# EasyEDA Pro project ProProject_keyboard_Tassel43_2024-03-30.epro, board Tassel43_Without_RGB_Mid
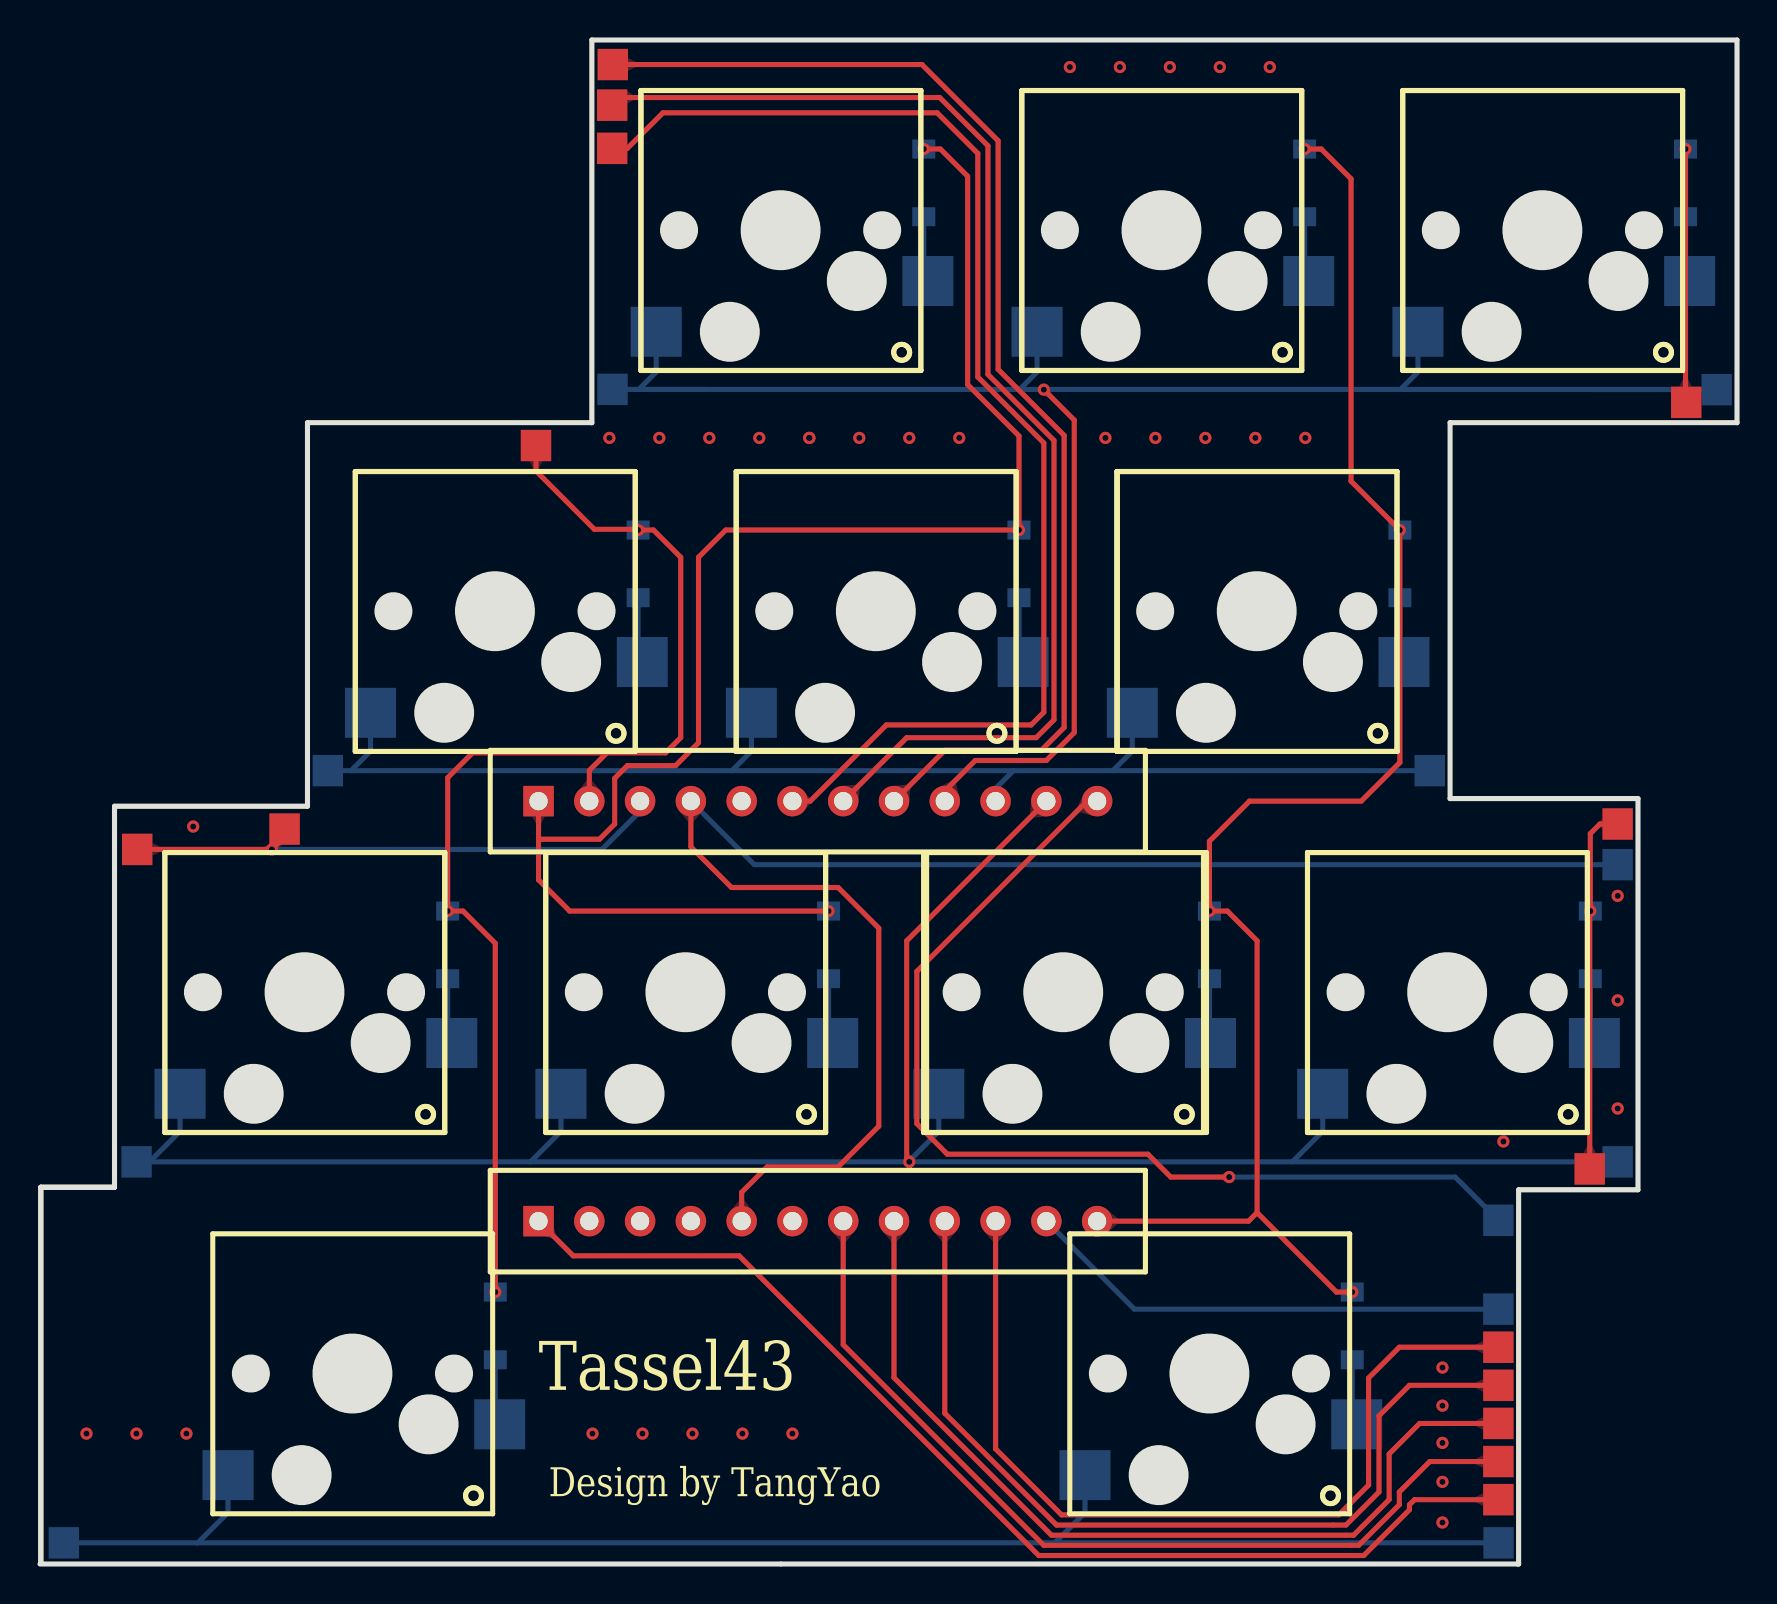
[diagram p5: board, top side]
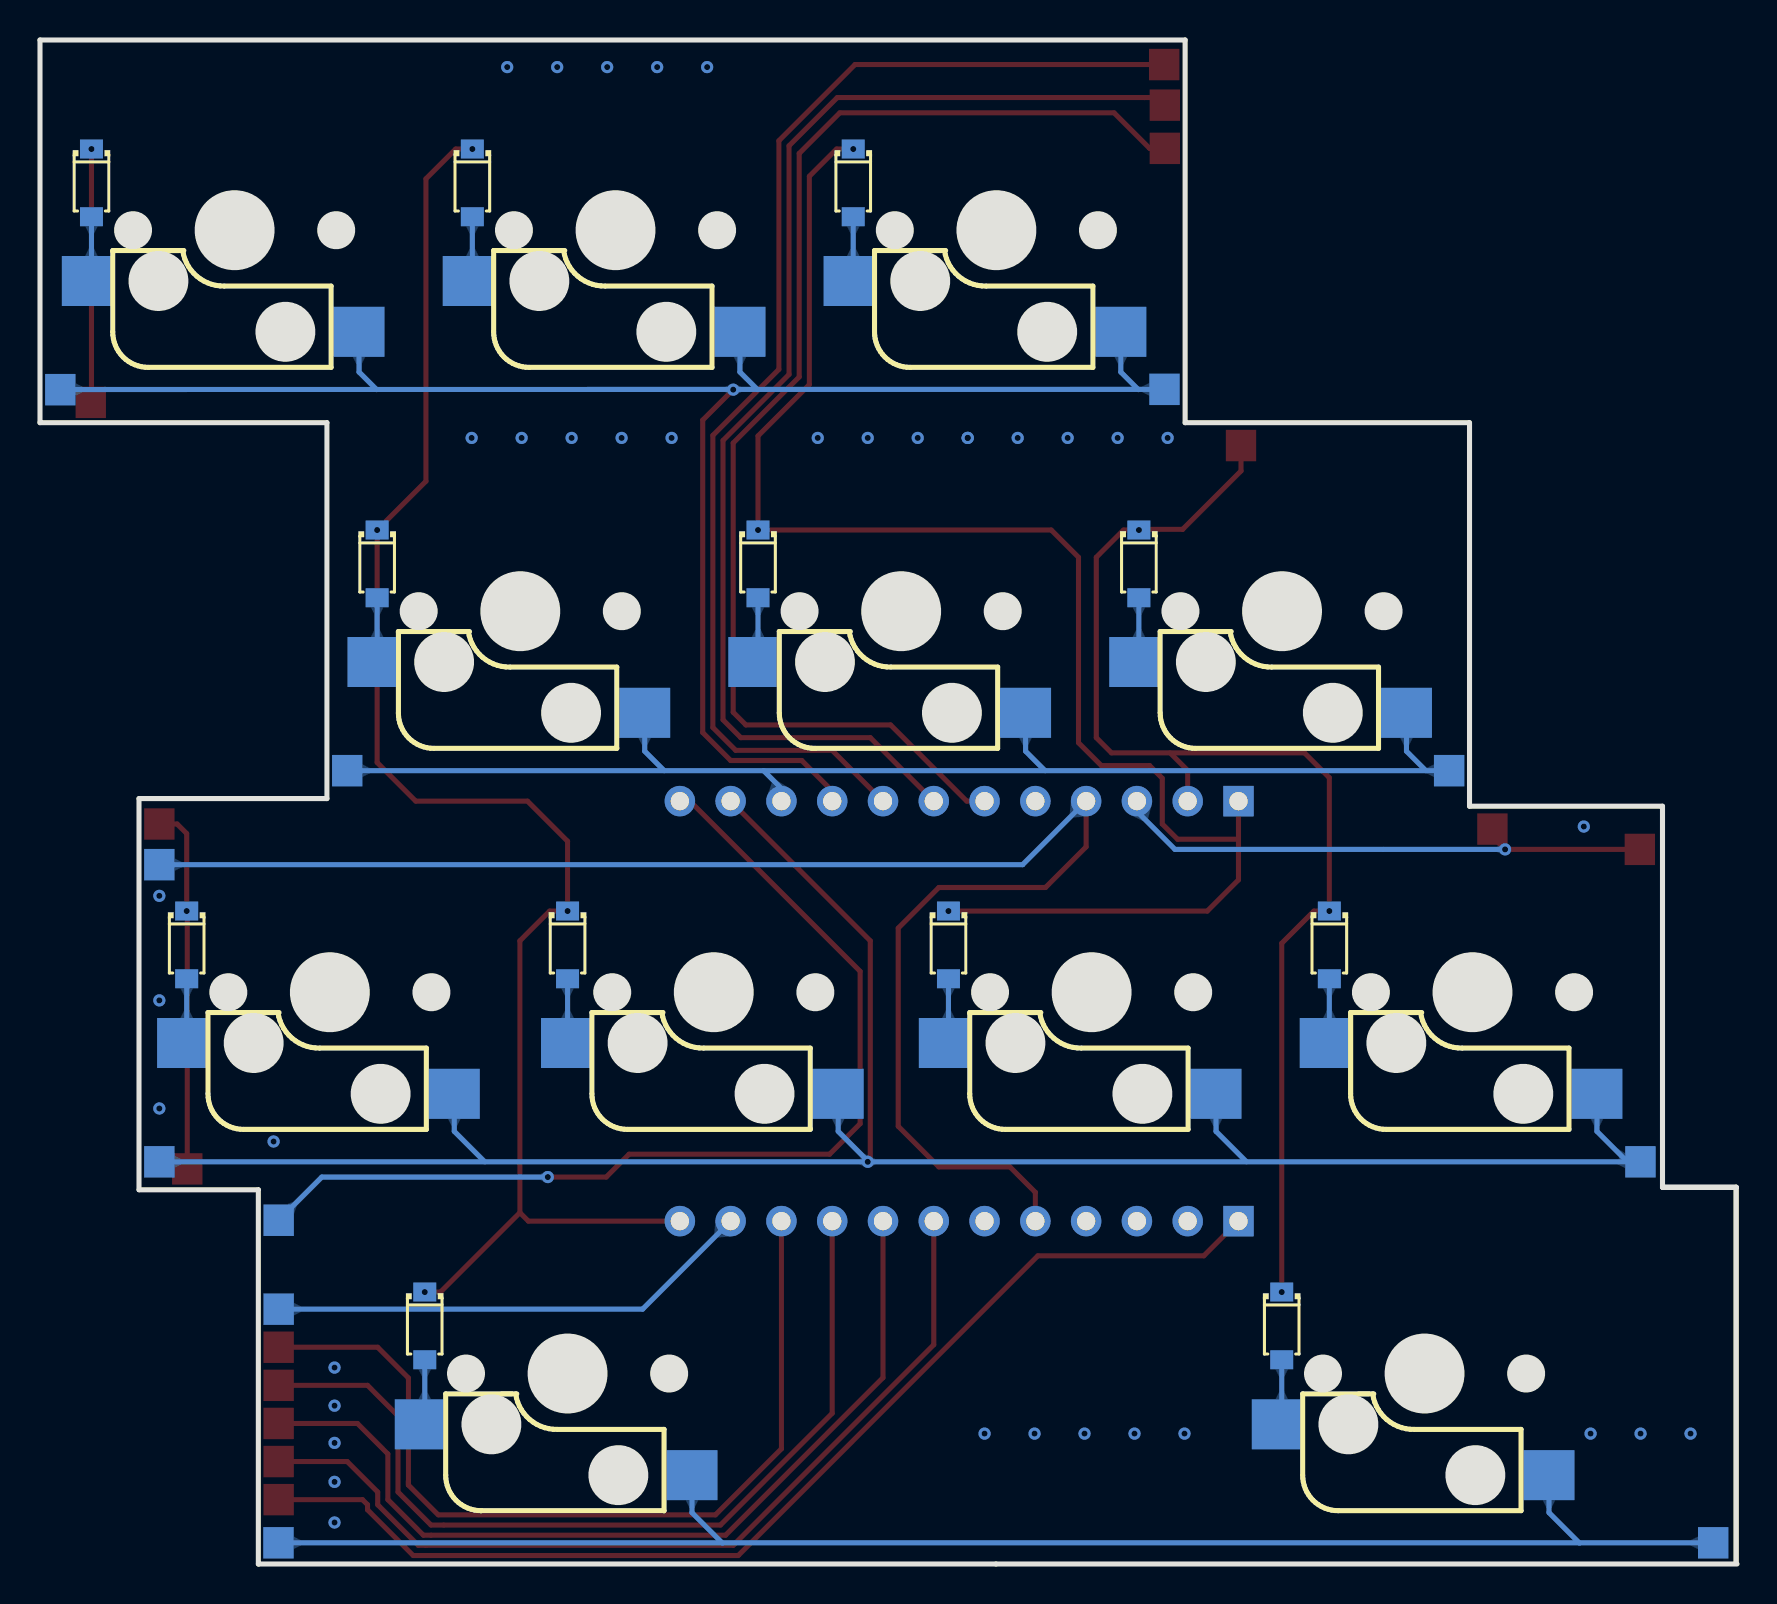
[diagram p6: board, bottom side, seen from below]

Outline 84.88 x 76.2 mm; copper layers: Top Layer, Bottom Layer. Coordinates in mm from the lower left corner of the outline.
Outline path: 0.04,18.84 0.04,0.04 0.04,18.84 ; 0.04,18.84 3.73,18.84 ; 0.04,18.84 3.73,18.84 ; 3.73,18.84 3.73,37.89 13.38,37.89 13.38,57.07 27.6,57.07 27.6,76.2 84.88,76.2 84.88,57.07 70.53,57.07 70.53,38.27 79.93,38.27 79.93,18.71 73.96,18.71 73.96,0 0,0
Stack: Top Layer 0.035mm / Dielectric1 1.51mm FR4 er 4.5 / Bottom Layer 0.035mm

## Design rules (mm)
spacing Default (default): track to track 0.152, other pairs 0 to 0.152
track width Default (default): min 0.254, default 0.254, max 25.4
differential pair differentialPair (default): width min 0.127, default 0.254, max 2.54; gap min 0.152, default 0.152
via Default (default): diameter min 0.61, default 0.61, max 100.025; hole min 0.305, default 0.305, max 59.995
net GND uses gge64594(1)
pour e267 uses gge64594
pour e689 uses gge64594(1)

## Placement (name value [footprint] x y rotation side)
B  -  [凯华热插拨]  51.18 28.59 0 top
C  -  [凯华热插拨]  13.23 28.59 0 top
D43  1N4148W  [SOD-123_L2.8-W1.8-LS3.7-RD]  22.77 11.9 270 bottom
D45  1N4148W  [SOD-123_L2.8-W1.8-LS3.7-RD]  65.63 11.9 270 bottom
D56  1N4148W  [SOD-123_L2.8-W1.8-LS3.7-RD]  20.39 30.96 270 bottom
D57  1N4148W  [SOD-123_L2.8-W1.8-LS3.7-RD]  39.44 30.96 270 bottom
D58  1N4148W  [SOD-123_L2.8-W1.8-LS3.7-RD]  58.49 30.96 270 bottom
D59  1N4148W  [SOD-123_L2.8-W1.8-LS3.7-RD]  77.54 30.96 270 bottom
D69  1N4148W  [SOD-123_L2.8-W1.8-LS3.7-RD]  29.92 50.01 270 bottom
D70  1N4148W  [SOD-123_L2.8-W1.8-LS3.7-RD]  48.97 50.01 270 bottom
D71  1N4148W  [SOD-123_L2.8-W1.8-LS3.7-RD]  68.02 50.01 270 bottom
D80  1N4148W  [SOD-123_L2.8-W1.8-LS3.7-RD]  82.3 69.06 270 bottom
D81  1N4148W  [SOD-123_L2.8-W1.8-LS3.7-RD]  63.25 69.06 270 bottom
D82  1N4148W  [SOD-123_L2.8-W1.8-LS3.7-RD]  44.2 69.06 270 bottom
F  -  [凯华热插拨]  22.76 47.64 0 top
G  -  [凯华热插拨]  41.81 47.64 0 top
H  -  [凯华热插拨]  60.86 47.64 0 top
LGUI6  -  [凯华热插拨]  15.63 9.52 0 top
LGUI7  -  [凯华热插拨]  58.49 9.52 0 top
N  -  [凯华热插拨]  70.38 28.59 0 top
NOREF  -  [Pad_e539]  4.86 35.73 0 top
NOREF#2  -  [Pad_e538]  28.62 72.94 0 top
NOREF#3  -  [Pad_e127]  4.83 20.11 0 top
NOREF#4  -  [Pad_e263]  78.91 20.11 0 top
NOREF#5  -  [Pad_e684]  72.94 5.12 0 top
NOREF#6  -  [Pad_e537]  28.65 74.97 0 top
NOREF#7  -  [Pad_e264]  78.91 34.97 0 top
NOREF#8  -  [Pad_e265]  69.51 39.67 0 top
NOREF#9  -  [Pad_e688]  82.34 58.08 0 top
NOREF#10  -  [Pad_e683]  72.94 7.03 0 top
NOREF#11  -  [Pad_e262]  72.94 17.19 0 top
NOREF#12  -  [Pad_e685]  72.94 3.22 0 top
NOREF#13  -  [Pad_e682]  72.94 8.93 0 top
NOREF#14  -  [Pad_e540]  24.81 55.92 0 top
NOREF#15  -  [Pad_e535]  12.23 36.75 0 top
NOREF#16  -  [Pad_e125]  14.4 39.67 0 top
NOREF#17  -  [Pad_e261]  72.95 1.06 0 top
NOREF#18  -  [Pad_e686]  77.51 19.76 0 top
NOREF#19  -  [Pad_e687]  78.91 37 0 top
NOREF#20  -  [Pad_e266]  83.86 58.72 0 top
NOREF#21  -  [Pad_e124]  1.19 1.06 0 top
NOREF#22  -  [Pad_e536]  28.62 70.78 0 top
NOREF#23  -  [Pad_e126]  28.63 58.73 0 top
NOREF#24  -  [Pad_e541]  72.94 10.84 0 top
NOREF#25  -  [Pad_e260]  72.94 12.74 0 top
T  -  [凯华热插拨]  37.04 66.69 0 top
U  -  [凯华热插拨]  75.14 66.69 0 top
U5  -  [1X12排针]  27.47 14.6 90 top
U6  -  [1X12排针]  27.47 35.6 90 top
V  -  [凯华热插拨]  32.28 28.59 0 top
Y  -  [凯华热插拨]  56.09 66.69 0 top

## Footprints (pads in the part's own frame, mm; a bottom-side part is the same pattern mirrored in y, then rotated)
1X12排针
  rect 1.524x1.524 hole 0.914: 1(2.54,2.54)
  round 1.524 hole 0.914: 2(2.541,0) 3(2.541,-2.54) 4(2.541,-5.08) 5(2.541,-7.62) 6(2.541,-10.16) 7(2.541,-12.7) 8(2.541,-15.24) 9(2.541,-17.78) 10(2.541,-20.32) 11(2.541,-22.86) 12(2.541,-25.4)
Pad_e124
  rect 1.52x1.57 smd far side: 34(0,0)
Pad_e125
  rect 1.52x1.57 smd far side: 35(0,0)
Pad_e126
  rect 1.52x1.57 smd far side: 30(0,0)
Pad_e127
  rect 1.52x1.57 smd far side: 33(0,0)
Pad_e260
  rect 1.52x1.57 smd far side: 38(0,0)
Pad_e261
  rect 1.52x1.57 smd far side: 50(0,0)
Pad_e262
  rect 1.52x1.57 smd far side: 52(0,0)
Pad_e263
  rect 1.52x1.57 smd far side: 56(0,0)
Pad_e264
  rect 1.52x1.57 smd far side: 58(0,0)
Pad_e265
  rect 1.52x1.57 smd far side: 62(0,0)
Pad_e266
  rect 1.52x1.57 smd far side: 66(0,0)
Pad_e535
  rect 1.52x1.57 smd: 31(0,0)
Pad_e536
  rect 1.52x1.57 smd: 9(0,0)
Pad_e537
  rect 1.52x1.57 smd: 28(0,0)
Pad_e538
  rect 1.52x1.57 smd: 29(0,0)
Pad_e539
  rect 1.52x1.57 smd: 32(0,0)
Pad_e540
  rect 1.52x1.57 smd: 36(0,0)
Pad_e541
  rect 1.52x1.57 smd: 33(0,0)
Pad_e682
  rect 1.52x1.57 smd: 42(0,0)
Pad_e683
  rect 1.52x1.57 smd: 44(0,0)
Pad_e684
  rect 1.52x1.57 smd: 46(0,0)
Pad_e685
  rect 1.52x1.57 smd: 48(0,0)
Pad_e686
  rect 1.52x1.57 smd: 55(0,0)
Pad_e687
  rect 1.52x1.57 smd: 60(0,0)
Pad_e688
  rect 1.52x1.57 smd: 64(0,0)
SOD-123_L2.8-W1.8-LS3.7-RD
  rect 0.95x1.15 smd: 1(-1.692,0) 2(1.692,0)
凯华热插拨
  rect 2.55x2.5 smd far side: K1(-6.223,-5.08) K2(7.366,-2.54)

## Nets
GND: U5.6 U6.5
V1_4: D57.2 V.K2
VCC: NOREF#7.58 U5.5 U6.4
B1_4: B.K2 D58.2
C9_4: C.K2 D56.2
CAPLED: NOREF#12.48 U5.1
COL0: NOREF#6.28 U6.8
COL1: NOREF#2.29 U6.7
COL2: NOREF#22.9 U6.6
COL3: NOREF.32 NOREF#15.31 U6.3
COL4: D43.1 D56.1 D69.1 NOREF#14.36 U6.2
COL5: D57.1 D70.1 D82.1 U6.1
COL6: D45.1 D58.1 D71.1 D81.1 U5.12
COL7: D59.1 D80.1 NOREF#9.64 NOREF#18.55 NOREF#19.60 NOREF#25.38 U5.11
COL8: NOREF#24.33 U5.10
COL9: NOREF#13.42 U5.9
COL10: NOREF#10.44 U5.8
COL11: NOREF#5.46 U5.7
D80_2: D80.2 U.K2
D81_2: D81.2 Y.K2
D82_2: D82.2 T.K2
D+: U5.3
D-: U5.2
F1_4: D69.2 F.K2
G1_4: D70.2 G.K2
H1_4: D71.2 H.K2
N1_4: D59.2 N.K2
RGB: U5.4
ROW0: NOREF#20.66 NOREF#23.30 T.K1 U.K1 U6.9 Y.K1
ROW1: F.K1 G.K1 H.K1 NOREF#8.62 NOREF#16.35 U6.10
ROW2: B.K1 C.K1 N.K1 NOREF#3.33 NOREF#4.56 U6.11 V.K1
ROW3: LGUI6.K1 LGUI7.K1 NOREF#11.52 NOREF#17.50 NOREF#21.34 U6.12
RSHIFT1_4: D45.2 LGUI7.K2
SPACE1_4: D43.2 LGUI6.K2

## Via types
v1: diameter 0.61, hole 0.305, Top Layer to Bottom Layer, 53 vias

## Routing (per net, layer and track width the routed paths; a pad name or vN(x,y) marks a point on that pad's centre or on a via; arc(x,y) is an arc through that point)
GND:
  vias: v1(2.33,6.52) v1(4.83,6.52) v1(7.33,6.52) v1(7.66,36.87) v1(27.63,6.52) v1(28.48,56.3) v1(30.13,6.52) v1(30.98,56.3) v1(32.63,6.52) v1(33.48,56.3) v1(35.13,6.52) v1(35.98,56.3) v1(37.63,6.52) v1(38.48,56.3) v1(38.48,56.3) v1(40.98,56.3) v1(43.48,56.3) v1(45.98,56.3) v1(51.51,74.85) v1(53.29,56.3) v1(54.01,74.85) v1(55.79,56.3) v1(56.51,74.85) v1(58.29,56.3) v1(59.01,74.85) v1(60.79,56.3) v1(61.51,74.85) v1(63.29,56.3) v1(70.15,9.82) v1(70.15,7.92) v1(70.15,6.06) v1(70.15,4.11) v1(70.15,2.08) v1(73.19,21.12) v1(78.91,33.41) v1(78.91,28.18) v1(78.91,22.78)
V1_4: length 3.3
  Bottom Layer w0.254: V.K2 39.44,26.26 D57.2
VCC: length 80.6
  Top Layer w0.254: 32.56,38.14 32.56,35.86 34.59,33.83 39.92,33.83 41.95,31.79 41.95,21.89 39.92,19.86 36.37,19.86 35.09,18.59 35.09,17.14
  Bottom Layer w0.254: 78.93,34.97 35.73,34.97 32.56,38.14
B1_4: length 3.2
  Bottom Layer w0.254: B.K2 58.49,26.1 D58.2
C9_4: length 3.3
  Bottom Layer w0.254: 20.6,26.05 20.39,26.26 D56.2
CAPLED: length 56.2
  Top Layer w0.254: 24.94,17.14 26.67,15.41 34.97,15.41 49.95,0.42 66.21,0.42 68.5,2.71 68.5,2.96 68.75,3.22 NOREF#12.48
COL0: length 61.6
  Top Layer w0.254: 42.72,38.14 45.25,40.68 50.08,40.68 51.22,41.83 51.22,56.43 47.92,59.73 47.92,71.16 44.11,74.97 NOREF#6.28
COL1: length 62.3
  Top Layer w0.254: 29.66,73.32 29,73.32 NOREF#2.29 ; 40.18,38.14 43.35,41.32 49.83,41.32 50.72,42.21 50.72,56.18 47.41,59.48 47.41,70.91 45,73.32 29.63,73.32
COL2: length 63.6
  Top Layer w0.254: NOREF#22.9 29.38,70.78 31.16,72.56 44.87,72.56 46.91,70.53 46.91,59.35 50.21,56.05 50.21,42.59 49.57,41.95 42.33,41.95 38.52,38.14 37.63,38.14
COL3: length 27.7
  Top Layer w0.254: NOREF#15.31 12.23,36.37 v1(11.6,35.73) NOREF.32
  Bottom Layer w0.254: v1(11.6,35.73) 28.11,35.73 30.02,37.64 30.02,38.14
COL4: length 61.7
  Top Layer w0.254: 28.35,40.56 27.48,39.68 U6.2 ; NOREF#14.36 24.81,54.65 27.73,51.73 29.92,51.73 ; 22.77,13.6 22.77,31.04 21.16,32.65 20.39,32.65 20.39,39.31 21.63,40.56 31.28,40.56 32.05,41.32 32.05,50.34 30.68,51.7 v1(29.92,51.7)
  vias: v1(20.39,32.65) v1(22.77,13.6)
COL5: length 77.8
  Top Layer w0.254: 44.2,70.75 45.03,70.75 46.4,69.39 46.4,58.97 48.97,56.4 48.97,51.7 34.3,51.7 32.94,50.34 32.94,41.06 31.79,39.92 29.38,39.92 28.75,39.29 28.75,37 27.98,36.24 24.94,36.24 ; 24.94,38.14 24.94,34.21 26.49,32.65 39.44,32.65
  vias: v1(39.44,32.65) v1(44.2,70.75) v1(48.97,51.7)
COL6: length 79
  Top Layer w0.254: 60.88,17.57 64.85,13.6 65.63,13.6 ; 60.88,17.57 60.88,31.16 59.39,32.65 58.49,32.65 58.49,36.14 60.5,38.14 66.08,38.14 68.02,40.08 v1(68.02,51.7) 65.58,54.14 65.58,69.26 64.08,70.75 v1(63.25,70.75) ; 60.88,17.57 60.45,17.14 U5.12
  vias: v1(58.49,32.65) v1(65.63,13.6)
COL7: length 55.4
  Top Layer w0.254: 82.3,70.75 82.3,58.17 ; 78.93,37 78.02,37 77.54,36.52 77.54,32.65 ; NOREF#18.55 77.51,32.68
  Bottom Layer w0.254: NOREF#25.38 54.74,12.74 50.34,17.14
  vias: v1(77.54,32.65) v1(82.3,70.75)
COL8: length 44.7
  Top Layer w0.254: 66.45,3.95 66.45,9.3 67.99,10.84 NOREF#24.33 ; 66.45,4.17 66.45,3.95 64.96,2.46 ; 47.8,17.14 47.8,5.76 51.1,2.46 64.94,2.46
COL9: length 44.7
  Top Layer w0.254: NOREF#13.42 68.5,8.93 66.97,7.41 66.97,3.6 65.32,1.95 50.84,1.95 45.25,7.54 45.25,17.14
COL10: length 45
  Top Layer w0.254: NOREF#10.44 69,7.03 67.48,5.5 67.48,3.22 65.7,1.44 50.59,1.44 42.72,9.31 42.72,17.14
COL11: length 45.2
  Top Layer w0.254: NOREF#5.46 69.51,5.12 67.99,3.6 67.99,2.96 65.96,0.93 50.21,0.93 40.18,10.97 40.18,17.14
D80_2: length 3.3
  Bottom Layer w0.254: 82.3,67.36 82.3,64.36 82.51,64.15
D81_2: length 3.3
  Bottom Layer w0.254: Y.K2 63.25,64.36 63.25,67.36
D82_2: length 3.3
  Bottom Layer w0.254: T.K2 44.2,64.36 44.2,67.36
F1_4: length 3.3
  Bottom Layer w0.254: 30.12,45.1 29.92,45.31 D69.2
G1_4: length 3.3
  Bottom Layer w0.254: 48.97,48.31 48.97,45.31 49.17,45.1
H1_4: length 3.3
  Bottom Layer w0.254: 68.22,45.1 68.02,45.31 D71.2
N1_4: length 3.3
  Bottom Layer w0.254: D59.2 77.54,26.26 N.K2
ROW0: length 91
  Top Layer w0.254: v1(50.21,58.72) 51.73,57.19 51.73,41.57 50.34,40.18 46.78,40.18 45.25,38.65 45.25,38.14
  Bottom Layer w0.254: T.K1 30.82,59.6 29.94,58.72 ; 49.87,61.61 49.87,59.6 48.99,58.72 ; 68.92,61.61 68.92,59.6 68.04,58.72 ; 83.86,58.72 NOREF#23.30
ROW1: length 66.8
  Bottom Layer w0.254: 15.56,39.67 16.53,40.64 F.K1 ; 48.68,39.67 47.8,38.78 U6.10 ; H.K1 54.63,40.64 53.66,39.67 ; 34.61,39.67 35.58,40.64 G.K1 ; NOREF#16.35 69.44,39.67
ROW2: length 111.2
  Top Layer w0.254: 50.34,38.14 43.35,31.16 43.35,20.24 v1(43.48,20.11)
  Bottom Layer w0.254: V.K1 26.06,21.63 24.53,20.11 ; 7.01,23.51 7.01,21.63 5.48,20.11 ; B.K1 44.96,21.63 43.43,20.11 ; 62.63,20.11 64.16,21.63 N.K1 ; 78.96,20.11 NOREF#3.33
ROW3: length 131.1
  Top Layer w0.254: 52.88,38.14 52.37,38.14 43.86,29.63 43.86,22.01 45.38,20.49 55.41,20.49 56.56,19.35 v1(59.48,19.35)
  Bottom Layer w0.254: v1(59.48,19.35) 70.78,19.35 72.94,17.19 ; 9.4,4.44 9.4,2.57 7.88,1.04 ; 50.74,1.04 52.27,2.57 52.27,4.44 ; NOREF#21.34 NOREF#17.50
RSHIFT1_4: length 3.3
  Bottom Layer w0.254: 65.86,6.98 65.63,7.21 65.63,10.21
SPACE1_4: length 3.3
  Bottom Layer w0.254: 22.99,6.98 22.77,7.21 D43.2

## Copper pours and planes (outline as drawn; the poured copper is in the pictures)
GND on Top Layer: -4.02,-0.34 -4.02,78.15 -4.27,78.4 87.29,78.4 87.29,-0.34
GND on Bottom Layer: -4.4,-0.34 -4.4,78.15 -4.66,78.4 86.91,78.4 86.91,-0.34

Small or netless copper shapes (teardrops, artwork), in the pictures only: 53 on Top Layer, 59 on Bottom Layer

## Text on the board
Top Solder Mask Layer: Design by TangYao | Tassel43
Top Silkscreen Layer: Design by TangYao | Tassel43
